# EAGLE schematic Regulated Linear Power Supply (EAGLE 9.6.2)
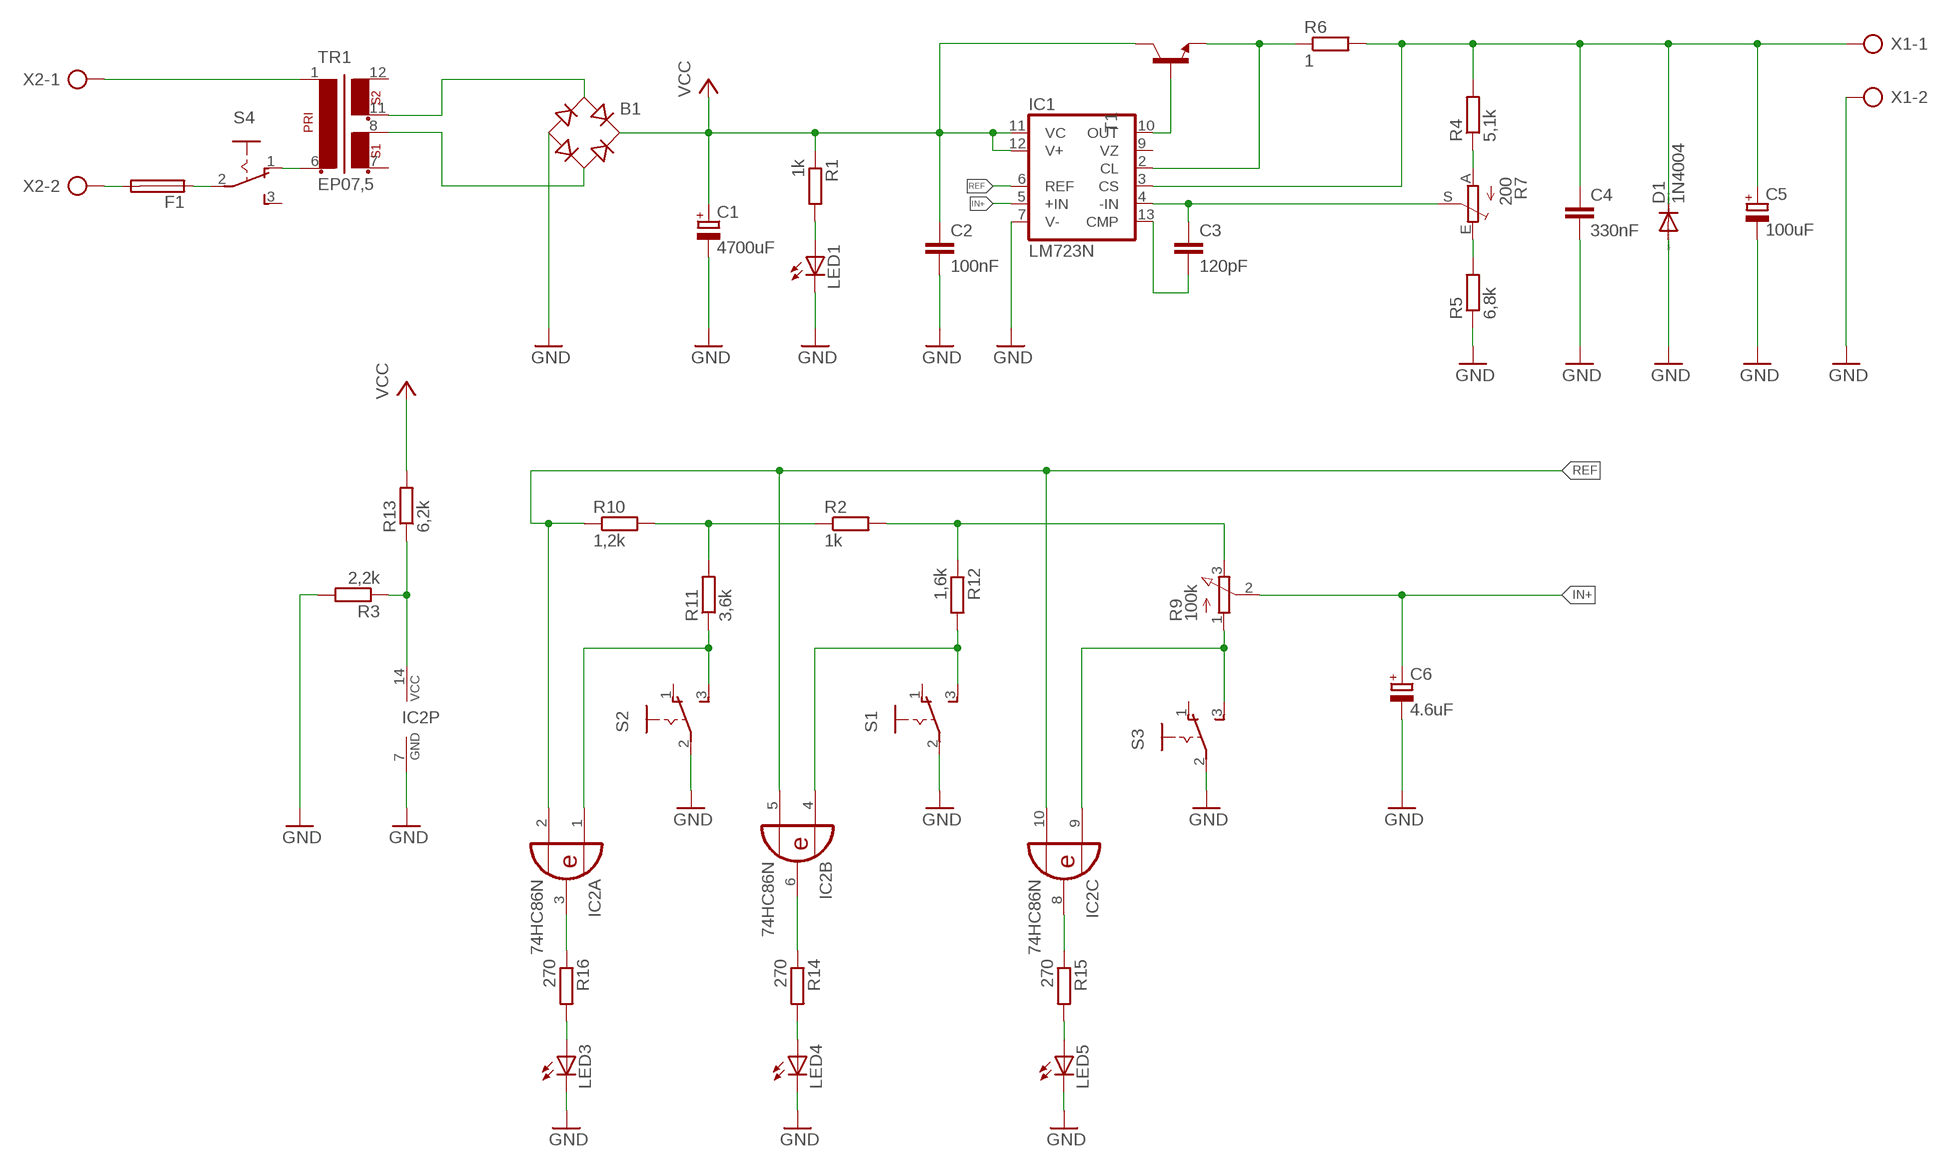
[diagram p0: schematic, sheet 1]

## Parts
B1  RB1A  [RB1A]
C1  4700uF  CPOL-EUE7.5-16  [E7,5-16]
C2  100nF  C-EU025-024X044  [C025-024X044]
C3  120pF  C-EU050-024X044  [C050-024X044]
C4  330nF  C-EU050-024X044  [C050-024X044]
C5  100uF  CPOL-EUE2,5-6E  [E2,5-6E]
C6  4.6uF  CPOL-EUE2-5  [E2-5]
D1  1N4004  [DO41-10]
F1  SH22,5A  [SH22,5A]
IC1  LM723N  [DIL14]
IC2  74HC86N  [DIL14]
LED1  LED5MM  [LED5MM]
LED3  LED5MM  [LED5MM]
LED4  LED5MM  [LED5MM]
LED5  LED5MM  [LED5MM]
R1  1k  R-EU_0207/7  [0207/7]
R2  1k  R-EU_0204/7  [0204/7]
R3  2,2k  R-EU_0204/7  [0204/7]
R4  5,1k  R-EU_0204/7  [0204/7]
R5  6,8k  R-EU_0207/7  [0207/7]
R6  1  R-EU_0204/7  [0204/7]
R7  200  TRIM_EU-CA6V  [CA6V]
R9  100k  3RP/1610N  [3RP/1610N]
R10  1,2k  R-EU_0204/7  [0204/7]
R11  3,6k  R-EU_0204/7  [0204/7]
R12  1,6k  R-EU_0204/7  [0204/7]
R13  6,2k  R-EU_0204/7  [0204/7]
R14  270  R-EU_0204/7  [0204/7]
R15  270  R-EU_0204/7  [0204/7]
R16  270  R-EU_0204/7  [0204/7]
S1  255SB  [255SB]
S2  255SB  [255SB]
S3  255SB  [255SB]
S4  M251  [M251]
T1  -NPN-TO220V  [TO220V]
TR1  EP07,5  [EP07,5]
X1  AK500/2-H  [AK500/2-H]
X2  AK500/2-H  [AK500/2-H]

## Nets
GND: B1.- C1.- C2.2 C4.2 C5.- C6.- D1.A IC1.7(V-) IC2.7(P:GND) LED1.K(C) LED3.K(C) LED4.K(C) LED5.K(C) R3.2 R5.1 S1.2(P) S2.2(P) S3.2(P) X1.2
IN+: C6.+ IC1.5(+IN) R9.2(S)
N$1: IC2.14(P:VCC) R3.1 R13.1
N$2: IC1.2(CL) R6.1 T1.3(E)
N$3: B1.AC1 TR1.11
N$4: B1.AC2 TR1.8
N$5: TR1.1 X2.1
N$6: R4.1 R7.A
N$7: R5.2 R7.E
N$8: C3.1 IC1.4(-IN) R7.S
N$9: LED1.A R1.2
N$10: C4.1 C5.+ D1.C IC1.3(CS) R4.2 R6.2 X1.1
N$11: IC1.10(OUT) T1.1(B)
N$12: IC2.6(B:O) R14.1
N$13: IC2.8(C:O) R15.1
N$14: IC2.3(A:O) R16.1
N$15: F1.2 X2.2
N$16: C3.2 IC1.13(CMP)
N$17: R2.2 R9.3(E) R12.1
N$18: IC2.9(C:I0) R9.1(A) S3.3(S)
N$19: F1.1 S4.2(P)
N$20: S4.1(O) TR1.6
N$21: IC2.1(A:I0) R11.1 S2.3(S)
N$22: IC2.4(B:I0) R12.2 S1.3(S)
N$23: R2.1 R10.2 R11.2
N$24: LED4.A R14.2
N$25: LED3.A R16.2
N$26: LED5.A R15.2
REF: IC1.6(REF) IC2.2(A:I1) IC2.5(B:I1) IC2.10(C:I1) R10.1
VCC: B1.+ C1.+ C2.1 IC1.11(VC) IC1.12(V+) R1.1 R13.2 T1.2(C)
Unconnected: IC1.9(VZ) IC2.11(D:O) IC2.12(D:I0) IC2.13(D:I1) S1.1(O) S2.1(O) S3.1(O) S4.3(S) TR1.7 TR1.12

## Library data of the parts
B1 = rectifier:RB1A: RECTIFIER 1 A
C1 C5 C6 = rcl:CPOL-EU: POLARIZED CAPACITOR, European symbol
C2-C4 = rcl:C-EU: CAPACITOR, European symbol
D1 = diode:1N4004: DIODE general purpose rectifier, 1 A
F1 = fuse:SH22,5A: FUSE HOLDER grid 22,5mm, isolated cap OGN0031 8201, Schurter (Buerklin); MPN: 0031.7701.11; OC_FARNELL: unknown; OC_NEWARK: 04F1224
IC1 = linear:*723: Positive VOLTAGE REGULATOR
IC2 = 74xx-eu:74*86: Quad 2-input EXCLUSIVE-OR (XOR) gate
LED1 LED3-LED5 = led:LED: LED OSRAM: - CHIPLED LG R971, LG N971, LY N971, LG Q971, LY Q971, LO R971, LY R971 LH N974, LH R974 LS Q976, LO Q976, LY Q976 LO Q996 - Hyper CHIPLED LW Q18S LB Q993, LB Q99A, LB R99A - SideLED LS A670, LO A670, LY A670, LG A670, LP A670 LB A673, LV A673, LT A673, LW A673 LH A674 LY A675 LS A676, LA A676, LO A676, LY A676, LW A676 LS A679, LY A679, LG A679 - Hyper Micro SIDELED® LS Y876, LA Y876, LO Y876, LY Y876 LT Y87S - SmartLED LW L88C, LW L88S LB L89C, LB L89S, LG L890 LS L89K, LO L89K, LY L89K LS L896, LA L896, LO L896, LY L896 - TOPLED LS T670, LO T670, LY T670, LG T670, LP T670 LSG T670, LSP T670, LSY T670, LOP T670, LYG T670 LG T671, LOG T671, LSG T671 LB T673, LV T673, LT T673, LW T673 LH T674 LS T676, LA T676, LO T676, LY T676, LB T676, LH T676, LSB T676, LW T676 LB T67C, LV T67C, LT T67C, LS T67K, LO T67K, LY T67K, LW E67C LS E67B, LA E67B, LO E67B, LY E67B, LB E67C, LV E67C, LT E67C LW T67C LS T679, LY T679, LG T679 LS T770, LO T770, LY T770, LG T770, LP T770 LB T773, LV T773, LT T773, LW T773 LH T774 LS E675, LA E675, LY E675, LS T675 LS T776, LA T776, LO T776, LY T776, LB T776 LHGB T686 LT T68C, LB T68C - Hyper Mini TOPLED® LB M676 - Mini TOPLED Santana® LG M470 LS M47K, LO M47K, LY M47K Source: http://www.osram.convergy.de LUXEON: - LUMILED® LXK2-PW12-R00, LXK2-PW12-S00, LXK2-PW14-U00, LXK2-PW14-V00 LXK2-PM12-R00, LXK2-PM12-S00, LXK2-PM14-U00 LXK2-PE12-Q00, LXK2-PE12-R00, LXK2-PE12-S00, LXK2-PE14-T00, LXK2-PE14-U00 LXK2-PB12-K00, LXK2-PB12-L00, LXK2-PB12-M00, LXK2-PB14-N00, LXK2-PB14-P00, LXK2-PB14-Q00 LXK2-PR12-L00, LXK2-PR12-M00, LXK2-PR14-Q00, LXK2-PR14-R00 LXK2-PD12-Q00, LXK2-PD12-R00, LXK2-PD12-S00 LXK2-PH12-R00, LXK2-PH12-S00 LXK2-PL12-P00, LXK2-PL12-Q00, LXK2-PL12-R00 Source: www.luxeon.com KINGBRIGHT: KA-3528ASYC Source: www.kingbright.com
R1-R6 R10-R16 = rcl:R-EU_: RESISTOR, European symbol
R7 = pot:TRIM_EU-: POTENTIOMETER
R9 = pot:3RP/1610N: 16mm Potentiometer one level Source: http://www.alphapotentiometers.net/html/16mm_pot_2.html
S1-S3 = switch:255SB: SLIDING SWITCH Distributor Buerklin, 11G810
S4 = switch:M251: SLIDING SWITCH Mors, distributor Buerklin, 11G702
T1 = transistor:*-NPN-: NPN Transistror BF959 corrected 2008.03.06
TR1 = trafo:EP07,5: TRANSFORMER 1 primary winding, 2 secondary windings BLOCK
X1 X2 = con-ptr500:AK500/2-H: CONNECTOR Aug. 2004 / PTR Meßtechnik: Die Bezeichnung der Serie AK505 wurde geändert. Es handelt sich hierbei um AK500 in horizontaler Ausführung.; OC_FARNELL: unknown; OC_NEWARK: unknown